# EAGLE design HSHV4-student version (EAGLE 7.2.0)
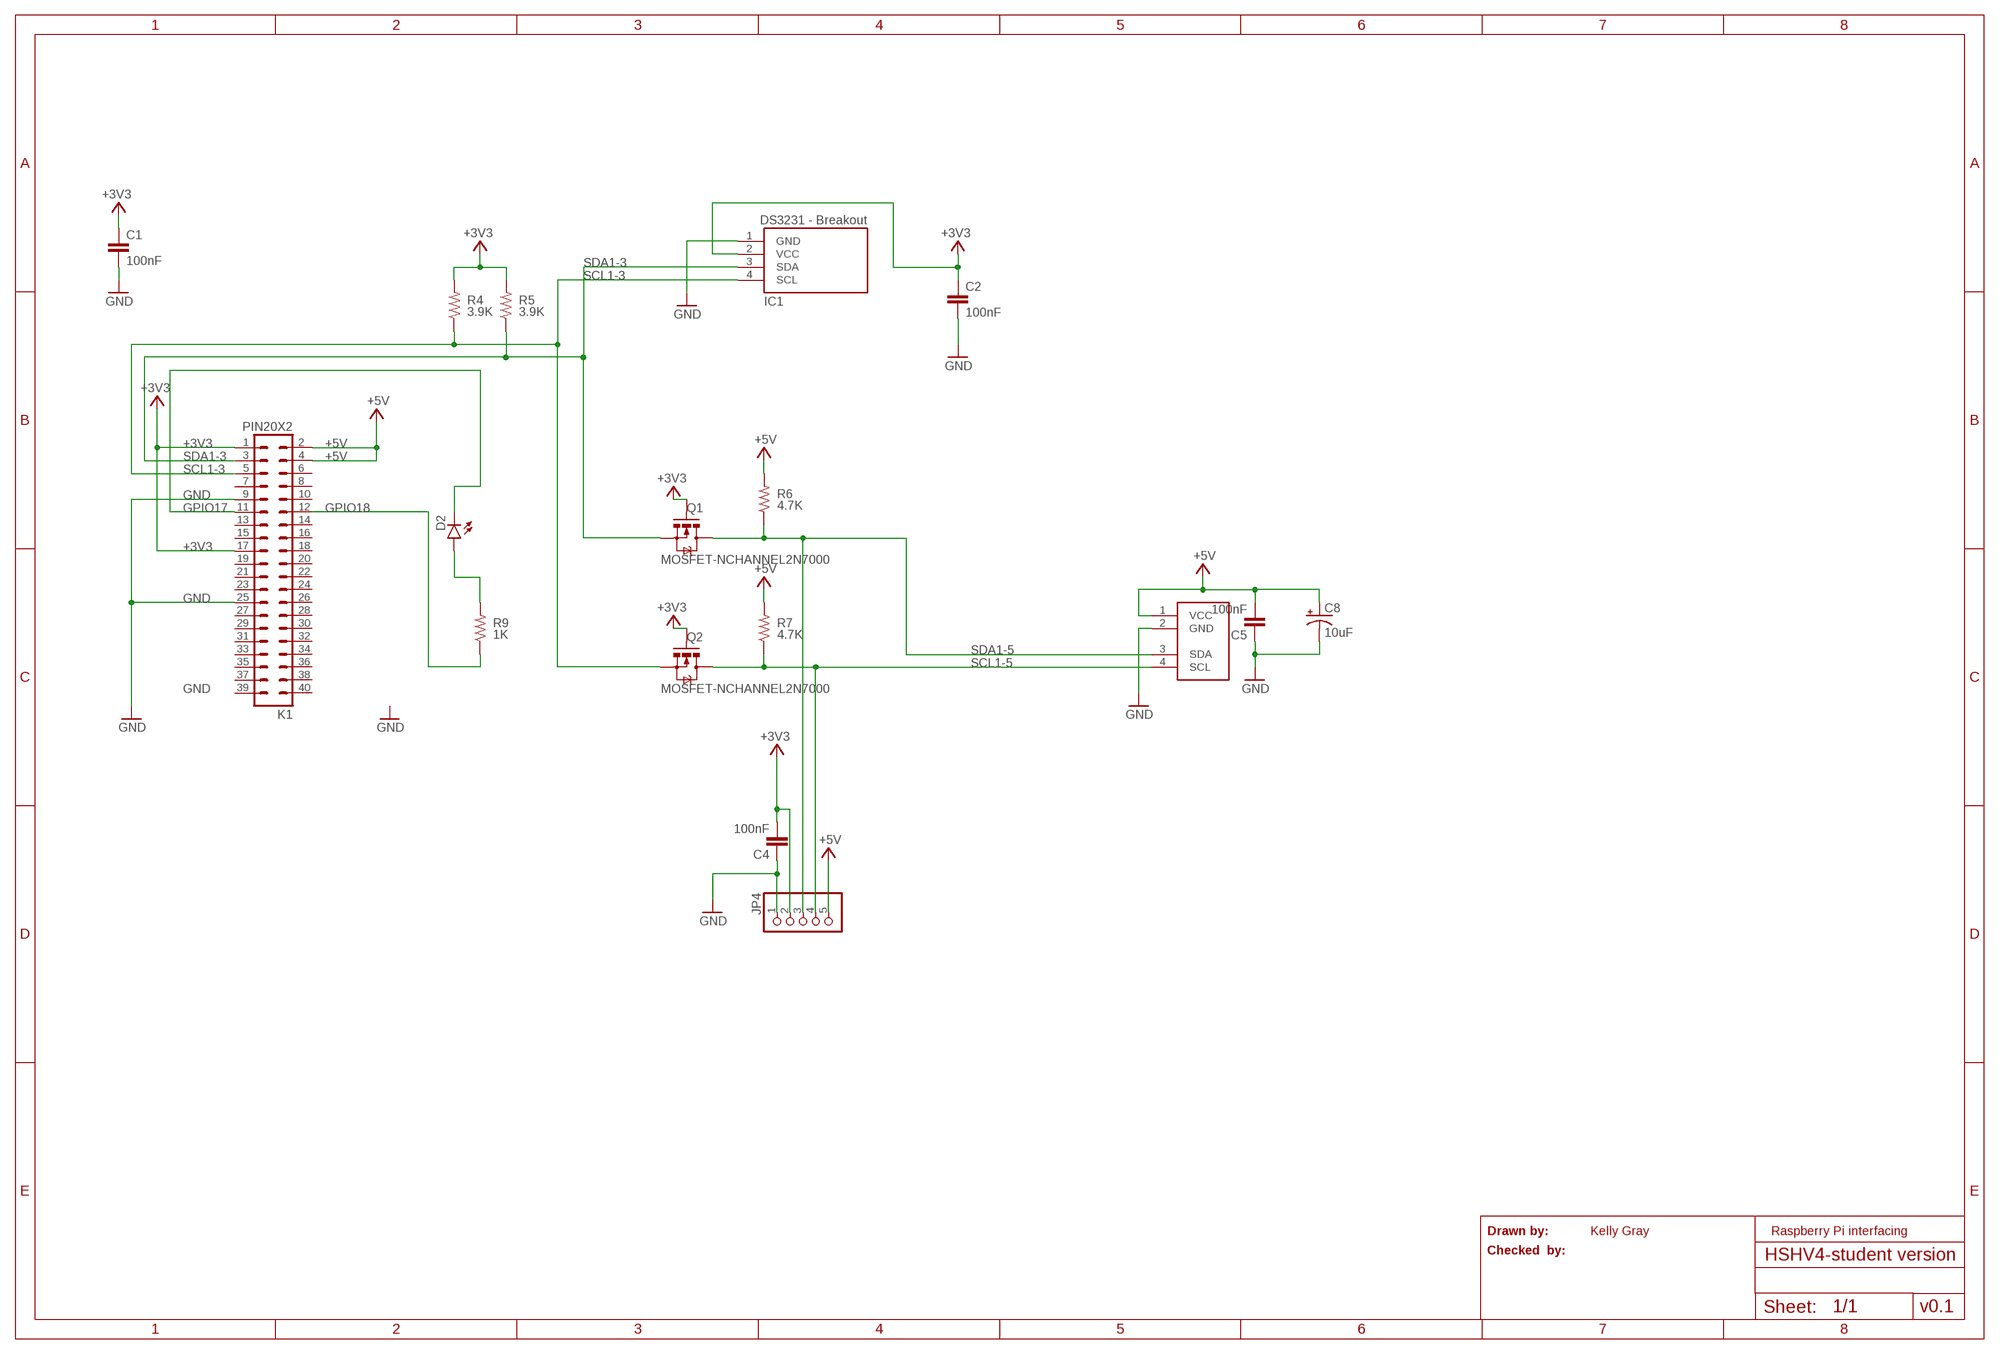
[diagram p0: schematic, sheet 1]

## Parts
C1  100nF  0.1UF-50V-20%(PTH)KIT-EZ  [CAP-PTH-SMALL-KIT]
C2  100nF  0.1UF-50V-20%(PTH)KIT-EZ  [CAP-PTH-SMALL-KIT]
C4  100nF  0.1UF-50V-20%(PTH)KIT-EZ  [CAP-PTH-SMALL-KIT]
C5  100nF  0.1UF-50V-20%(PTH)KIT-EZ  [CAP-PTH-SMALL-KIT]
C8  10uF  10UF-25V-20%(PTH)  [CPOL-RADIAL-10UF-25V]
D2  LED-3MM-NO_SILK  [LED3MM-NS]
IC1  DS3231  [8PTH]
JP4  PINHD-1X5  [1X05]
K1  PIN20X2  [PIN_20X2]
Q1  MOSFET-NCHANNEL2N7000  [TO-92]
Q2  MOSFET-NCHANNEL2N7000  [TO-92]
R4  3.9K  1KOHM-1/4W-1%(PTH)  [AXIAL-0.3]
R5  3.9K  1KOHM-1/4W-1%(PTH)  [AXIAL-0.3]
R6  4.7K  1KOHM-1/4W-1%(PTH)  [AXIAL-0.3]
R7  4.7K  1KOHM-1/4W-1%(PTH)  [AXIAL-0.3]
R9  1K  1KOHM-1/4W-1%(PTH)  [AXIAL-0.3]
U$1  PCF8591  [1X04]

## Nets
+3V3: C1.1 C2.1 C4.2 IC1.2(VCC) JP4.2 K1.1 K1.17 Q1.2(G) Q2.2(G) R4.P$2 R5.P$2
+5V: C5.2 C8.1(+) JP4.5 K1.2 K1.4 R6.P$2 R7.P$2 U$1.1(VCC)
GND: C1.2 C2.2 C4.1 C5.1 C8.2(-) IC1.1(GND) JP4.1 K1.9 K1.25 U$1.2(GND)
GPIO17: D2.K(C) K1.11
GPIO18: K1.12 R9.P$1
N$2: D2.A R9.P$2
SCL1-3: IC1.4(SCL) K1.5 Q2.1(S) R4.P$1
SCL1-5: JP4.4 Q2.3(D) R7.P$1 U$1.4(SCL)
SDA1-3: IC1.3(SDA) K1.3 Q1.1(S) R5.P$1
SDA1-5: JP4.3 Q1.3(D) R6.P$1 U$1.3(SDA)
Unconnected: K1.6 K1.7 K1.8 K1.10 K1.13 K1.14 K1.15 K1.16 K1.18 K1.19 K1.20 K1.21 K1.22 K1.23 K1.24 K1.26 K1.27 K1.28 K1.29 K1.30 K1.31 K1.32 K1.33 K1.34 K1.35 K1.36 K1.37 K1.38 K1.39 K1.40

## Notes on the sheet
- Drawn by: | Kelly Gray | Raspberry Pi interfacing
- Checked  by:
- v0.1

## Library data of the parts
C1 C2 C4 C5 = SparkFun-Capacitors:0.1UF-50V-20%(PTH): CAP-08370; DIELECTRIC: X7R; PROD_ID: CAP-08370
C8 = SparkFun-Capacitors:10UF-25V-20%(PTH): CAP-08440; DIELECTRIC: X7R; PROD_ID: CAP-08440
D2 = SparkFun-LED:LED: LEDs Standard schematic elements and footprints for 5mm, 3mm, 1206, and 0603 sized LEDs. 5mm - Spark Fun Electronics SKU : COM-00529 (and others)
IC1 = SenseHat:DS3231
JP4 = pinhead:PINHD-1X5: PIN HEADER
K1 = FLYFISH:PIN20X2
Q1 Q2 = SparkFun-DiscreteSemi:MOSFET-NCHANNEL: Common NMOSFET Parts MFG P/N Store ID Prod ID FDD8780 TRANS-09984 SI7820DN TRANS-11055 FDS6630A IC-08089 2N7002PW TRANS-11151 FQP30N06L COM-10213 TRANS-10060 BSS123LT1G TRANS-08345 BSS138 TRANS-00830 BS170 2N7000
R4-R7 = SparkFun-Resistors:1KOHM-1/4W-1%(PTH): RES-12182; PROD_ID: RES-12182; TOLERANCE: 5%; VALUE: 1K
R9 = SparkFun-Resistors:1KOHM-1/4W-1%(PTH): RES-12182; PROD_ID: RES-12182; TOLERANCE: 5%
U$1 = SenseHat:PCF8591

## Board
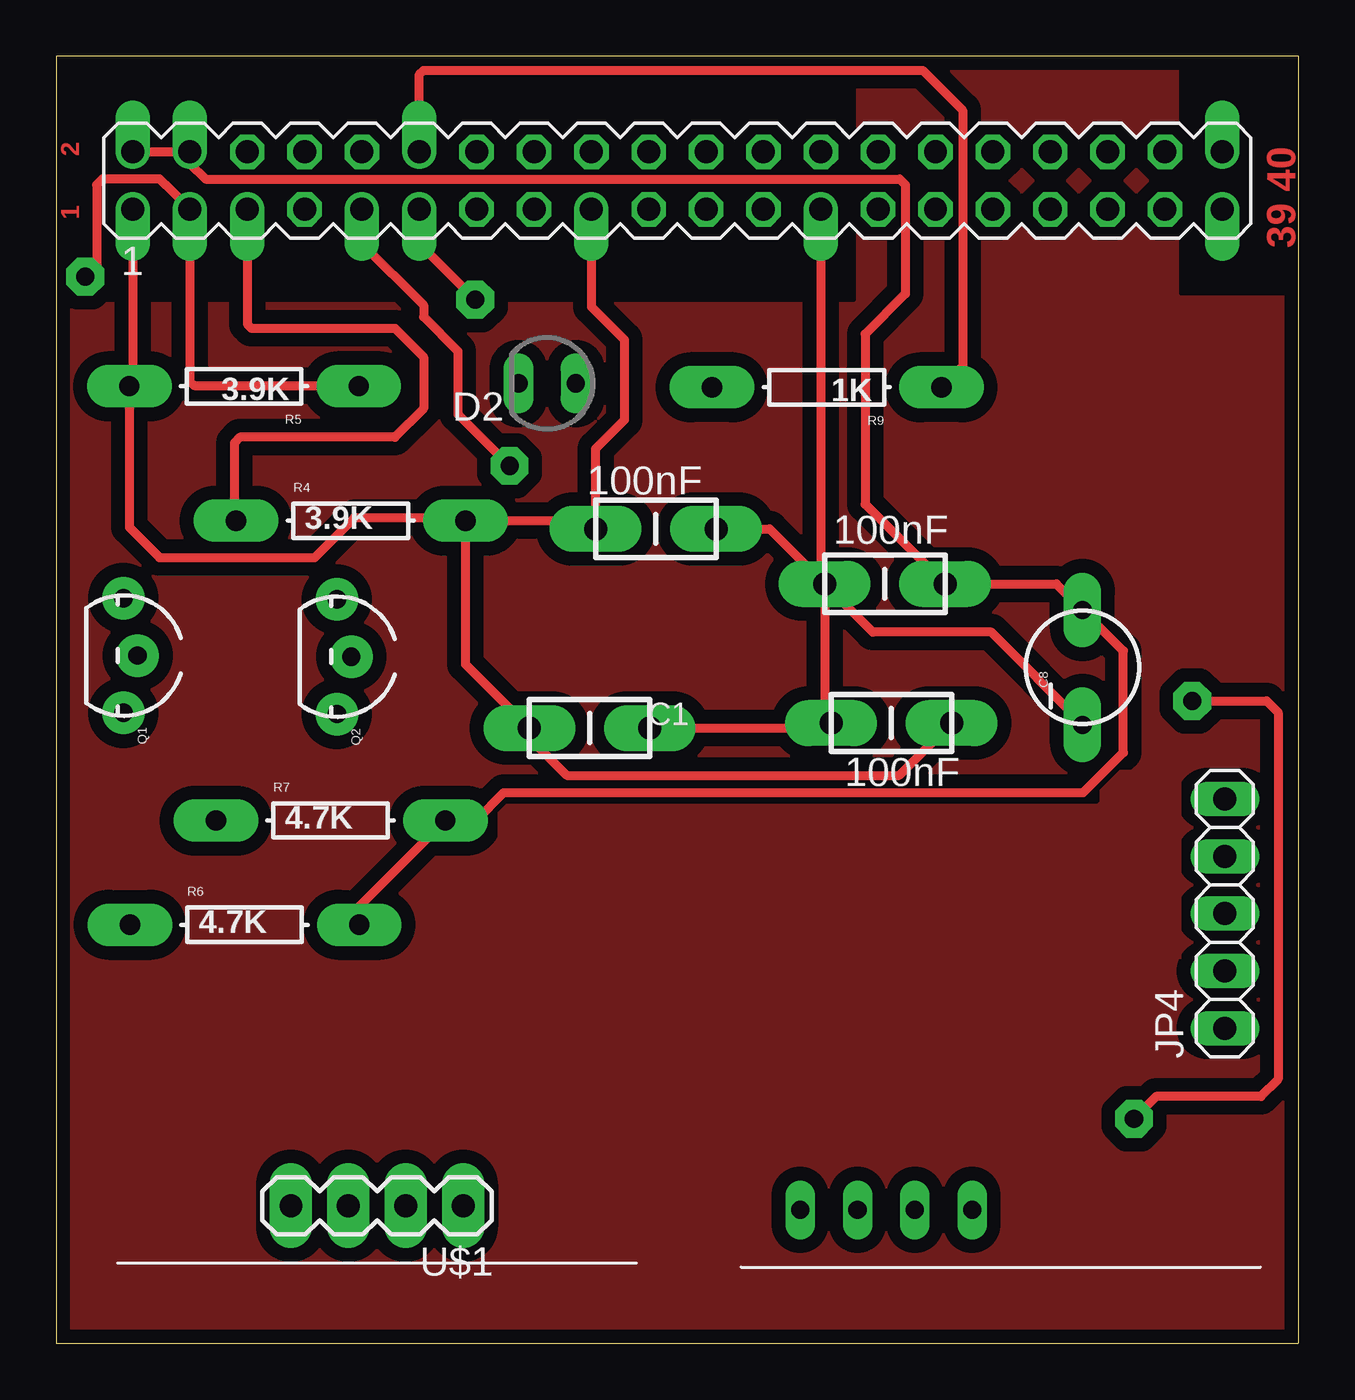
[diagram p1: board, top side]
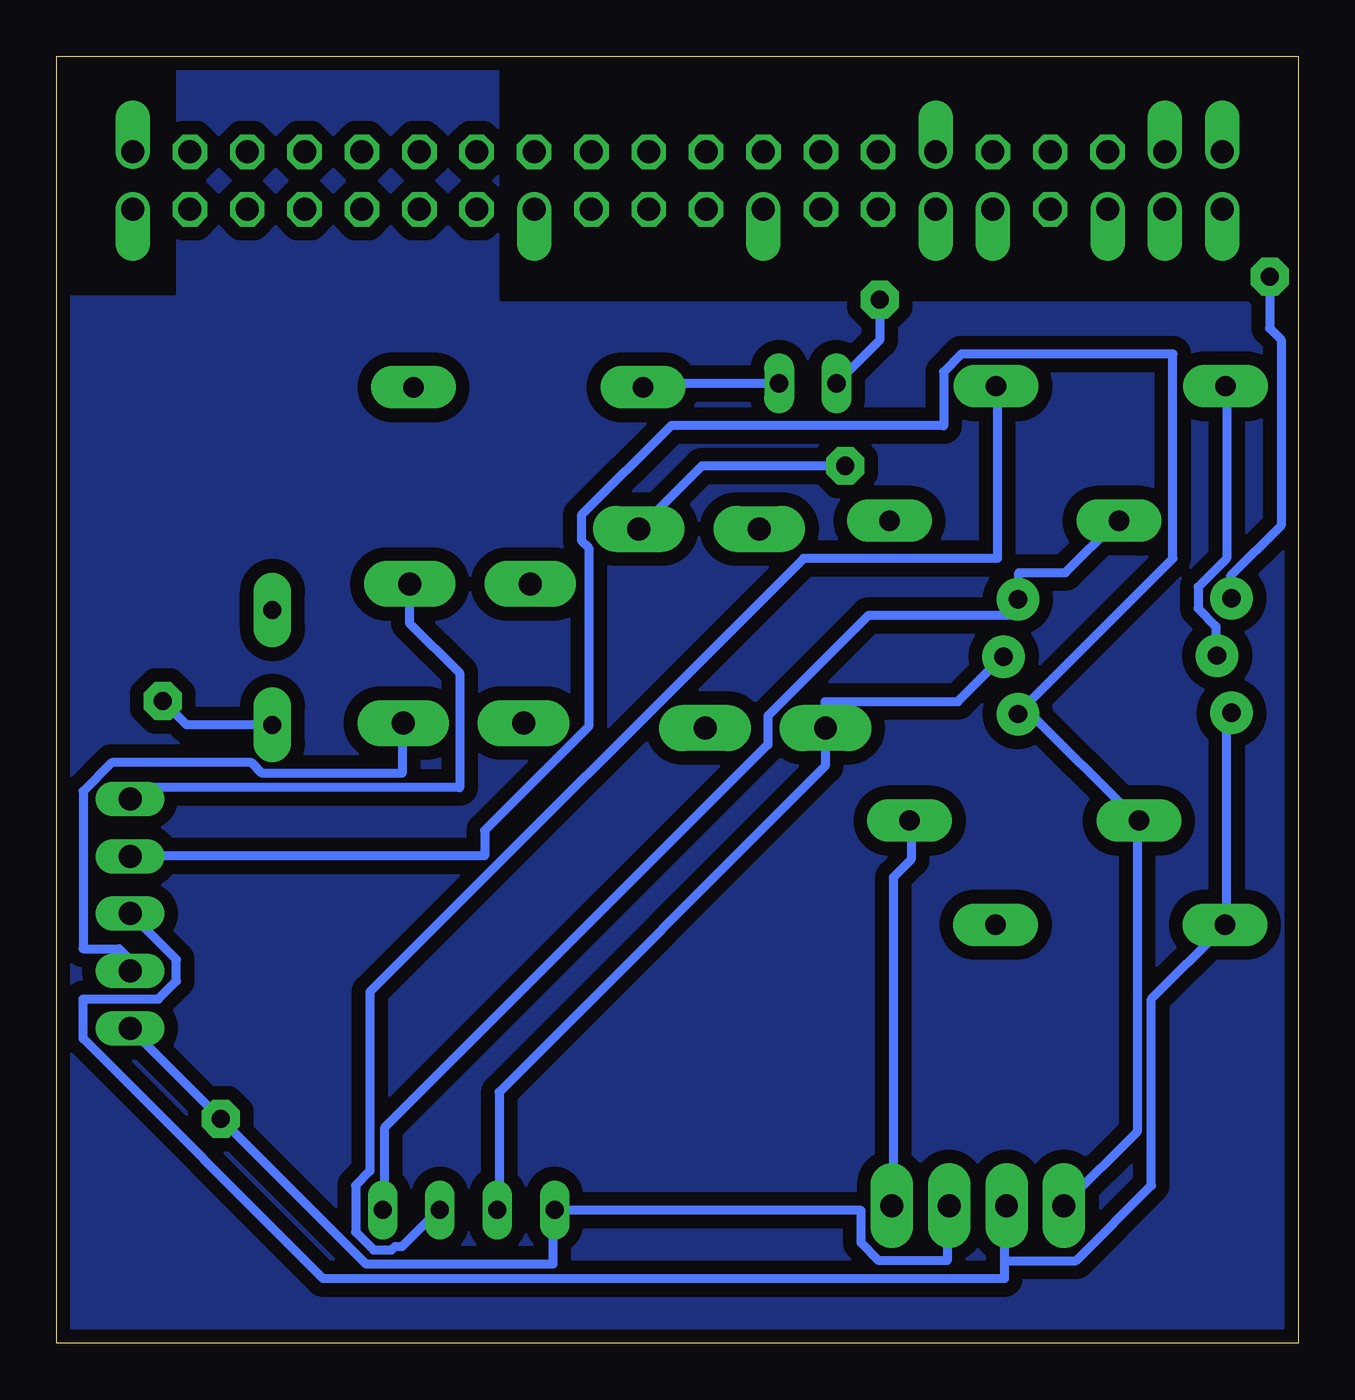
[diagram p2: board, bottom side, seen from below]

Size 55 x 57 mm. Coordinates in mm from the lower left corner, seen from the top.
Outline: 0,0 55,0 55,57 0,57 0,0
Copper layers (1*16): Top 0.035mm / dielectric 1.5mm / Bottom 0.035mm
Design rules "SparkFun *": minimum track width 16mil, minimum drill 20mil, track to track 8mil, track to pad 8mil, pad to pad 8mil, via to via 8mil, smd to smd 8mil, copper to edge 10mil, drill to drill 8mil, minimum pad ring 10mil, minimum via ring 10mil, stop-mask expansion 4mil, vias tented up to drill 25mil, thermal gap 10mil

### Footprints (pad centres in the part's own frame; a part is rotated, then mirrored left to right if it is on the bottom)
CAP-PTH-SMALL-KIT = drill 1.016 pad 2.032 long: 1 -2.667,0; 2 2.667,0
CPOL-RADIAL-10UF-25V = drill 0.8 pad 1.651 long: 1 2.54,0; 2 -2.54,0
LED3MM-NS = drill 0.813 long: A -1.27,0; K 1.27,0
8PTH = drill 0.8 pad 1.27 long: 1 -3.81,0; 2 -1.27,0; 3 1.27,0; 4 3.81,0
1X05 = drill 1.016 long: 1 -5.08,0; 2 -2.54,0; 3 0,0; 4 2.54,0; 5 5.08,0
PIN_20X2 = drill 1.016 offset: 1 -24.13,-1.27; 2 -24.13,1.27; 3 -21.59,-1.27; 4 -21.59,1.27; 5 -19.05,-1.27; 9 -13.97,-1.27; 11 -11.43,-1.27; 12 -11.43,1.27; 17 -3.81,-1.27; 25 6.35,-1.27; 39 24.13,-1.27; 40 24.13,1.27 | drill 1.016 octagon: 6 -19.05,1.27; 7 -16.51,-1.27; 8 -16.51,1.27; 10 -13.97,1.27; 13 -8.89,-1.27; 14 -8.89,1.27; 15 -6.35,-1.27; 16 -6.35,1.27; 18 -3.81,1.27; 19 -1.27,-1.27; 20 -1.27,1.27; 21 1.27,-1.27; 22 1.27,1.27; 23 3.81,-1.27; 24 3.81,1.27; 26 6.35,1.27; 27 8.89,-1.27; 28 8.89,1.27; 29 11.43,-1.27; 30 11.43,1.27; 31 13.97,-1.27; 32 13.97,1.27; 33 16.51,-1.27; 34 16.51,1.27; 35 19.05,-1.27; 36 19.05,1.27; 37 21.59,-1.27; 38 21.59,1.27
TO-92 = drill 0.813 pad 1.88: 1 -2.54,0; 2 0,0.635; 3 2.54,0
AXIAL-0.3 = drill 0.9 pad 1.88 long: P$1 -5.08,0; P$2 5.08,0
1X04 = drill 1.016 pad 1.88 long: 1 -3.81,0; 2 -1.27,0; 3 1.27,0; 4 3.81,0

### Placement (x,y rotation side)
C1  23.61,27.25 0 top
C2  36.98,27.47 180 top
C4  26.54,36.07 180 top
C5  36.69,33.63 0 top
C8  45.44,29.93 90 top
D2  21.73,42.51 180 top
IC1  36.75,5.9 0 top
JP4  51.74,19.03 90 top
K1  27.5,51.5 0 top
Q1  2.96,30.46 270 top
Q2  12.42,30.41 270 top
R4  13.03,36.43 0 top
R5  8.31,42.39 180 top
R6  8.33,18.53 0 top
R7  12.14,23.15 0 top
R9  34.11,42.34 180 top
U$1  14.2,6.08 180 top

### Tracks (layer width: path | path; a pad name or v marks a point on that pad's centre or on a via)
+3V3
  Top 0.406: K1.1 3.37,42.53 R5.P$2 3.23,36.14 4.57,34.8 11.43,34.8 13.21,36.58 17.96,36.58 R4.P$2 | K1.17 23.69,45.91 25.15,44.45 25.15,40.89 23.88,39.62 C4.2 23.51,36.43 R4.P$2 | R4.P$2 18.11,30.08 C1.1 20.94,26.81 22.61,25.15 37.32,25.15 C2.1
  Bottom 0.406: IC1.2 35.4,6.03 35.4,11.11 20.95,25.56 20.95,27.15 C1.1 20.95,27.3 20.95,28.42 15.08,28.42 13.18,30.32 Q2.2 | JP4.2 51.75,16.51 51.75,16.99 52.23,17.46 53.82,17.46 53.82,24.45 52.55,25.72 46.35,25.72 45.88,25.24 39.69,25.24 39.69,27.46 C2.1 | Q1.2 3.65,30.48 3.65,31.75 4.45,32.54 4.45,33.5 3.17,34.77 3.17,42.39 R5.P$2
+5V
  Top 0.406: K1.2 K1.4 5.91,52.26 6.6,51.56 37.34,51.56 37.59,51.31 37.59,46.48 35.81,44.7 35.81,37.17 C5.2 44.28,33.63 C8.1 | R6.P$2 13.41,19.34 R7.P$2 18.58,23.15 19.81,24.38 45.47,24.38 47.24,26.16 47.24,30.66 C8.1 | C8.1 45.51,32.47
  Bottom 0.406: JP4.5 51.59,24.13 51.12,24.61 37.15,24.61 37.15,29.69 39.37,31.91 39.37,33.5 C5.2 | U$1.1 17.94,6.19 17.94,20.64 17.14,21.43 17.14,23.02 R7.P$2
GND  (via drill 0.8 pad 1.68)
  Top 0.406: K1.25 33.85,33.8 C5.1 | C5.1 34.02,27.76 C2.2 34.09,27.25 C1.2 | C8.2 45.44,27.46 41.4,31.5 36.15,31.5 C5.1 | C4.1 31.58,36.07 C5.1 | K1.9 13.53,48.7 16.26,45.97 16.26,45.47 17.78,43.94 17.78,41.15 v20.07,38.86 | v50.29,28.45 53.59,28.45 54.1,27.94 54.1,11.68 53.34,10.92 48.7,10.92 v47.72,9.94
  Bottom 0.406: v20.07,38.86 26.42,38.86 C4.1 | U$1.2 15.56,6.03 15.56,3.65 18.57,3.65 19.37,4.45 19.37,5.87 32.86,5.87 IC1.1 33.02,5.71 33.02,3.49 41.27,3.49 47.34,9.56 v47.72,9.94 51.59,13.81 JP4.1 | C8.2 49.23,27.39 v50.29,28.45
GPIO17  (via drill 0.8 pad 1.68)
  Top 0.406: K1.11 16.07,48.7 v18.54,46.23
  Bottom 0.406: v18.54,46.23 18.54,44.43 D2.K
GPIO18
  Top 0.406: K1.12 16.07,56.2 16.26,56.39 38.35,56.39 40.13,54.61 40.13,43.29 R9.P$1
N$1
  pour Bottom (isolate 0.61): 0,56.9 55.12,56.9 55.12,0 0,0
N$2
  Bottom 0.406: D2.A 28.86,42.51 R9.P$2
N$3
  pour Top (isolate 0.61): 0,56.9 55.12,56.9 55.12,0 0,0
  pour Top: 19.56,23.88 49.78,23.88 49.78,17.02 19.56,17.02
  pour Top: 46.23,25.4 49.78,25.4 49.78,22.86 46.23,22.86
  pour Top: 44.96,17.53 49.53,17.53 49.53,11.94 44.96,11.94
  pour Top: 30.73,14.99 42.67,14.99 42.67,7.87 30.73,7.87
  pour Top: 8.13,15.24 20.57,15.24 20.57,8.64 8.13,8.64
N$4
  cutout Top (isolate 0.813): 49.78,56.9 54.36,56.9 54.36,46.48 49.78,46.48
  cutout Bottom (isolate 0.813): 49.78,56.9 54.36,56.9 54.36,46.48 49.78,46.48
N$5
  cutout Top (isolate 0.813): 0,56.9 35.31,56.9 35.31,46.23 0,46.23
  cutout Bottom (isolate 0.813): 0,56.9 35.31,56.9 35.31,46.23 0,46.23
SCL1-3
  Top 0.406: K1.5 8.45,45.14 8.64,44.96 14.99,44.96 16.26,43.69 16.26,41.4 14.99,40.13 8.13,40.13 7.87,39.88 7.87,36.51 R4.P$1
  Bottom 0.406: IC1.4 40.48,6.03 40.48,9.53 23.5,26.51 23.5,27.78 19.05,32.23 12.38,32.23 12.38,32.86 Q2.1 12.38,33.02 12.38,34.13 10.32,34.13 8.1,36.35 R4.P$1
SCL1-5
  Bottom 0.406: JP4.4 51.59,21.59 36.04,21.59 36.04,22.7 31.43,27.3 31.43,35.24 31.75,35.56 31.75,36.67 27.78,40.64 15.72,40.64 15.72,43.02 14.92,43.81 5.56,43.81 5.56,34.77 12.38,27.94 Q2.3 12.06,28.1 7.14,23.18 R7.P$1 7.14,23.02 7.14,9.37 10.32,6.19 U$1.4
SDA1-3  (via drill 0.8 pad 1.68)
  Top 0.406: R5.P$1 13.36,42.42 6.1,42.42 5.91,42.6 K1.3 4.83,51.31 4.57,51.56 2.03,51.56 1.78,51.31 1.78,47.75 v1.27,47.24
  Bottom 0.406: IC1.3 38.1,5.87 39.69,4.29 40.01,4.29 40.16,4.13 40.96,4.13 41.75,4.92 41.75,6.99 41.12,7.62 41.12,15.56 21.91,34.77 13.34,34.77 13.34,42.39 R5.P$1 | Q1.1 3.02,33.02 3.02,33.97 0.76,36.23 0.76,44.45 1.27,44.96 v1.27,47.24 | 5.87,50.16 K1.3
SDA1-5
  Bottom 0.406: Q1.3 3.02,27.78 3.17,27.62 3.17,18.57 R6.P$1 3.33,18.41 6.51,15.24 6.51,6.99 9.84,3.65 13.02,3.65 | 13.02,3.65 13.02,6.03 U$1.3 | 13.02,3.65 13.02,2.86 43.18,2.86 53.82,13.49 53.82,15.24 50.48,15.24 49.69,16.03 49.69,16.99 51.59,18.89 JP4.3

### Text on the board
Top: 2 | 1 | 39 40
tRestrict: 5V | SCL | YourName .I | SDA | VCC | DS-RTC | GND | PCF - ADC | GND | VCC | SDA | SCL | SCL | SDA | GND | VCC